# EAGLE design fanRegulator2 (EAGLE 7.6.0)

## Sheet 1 of 2
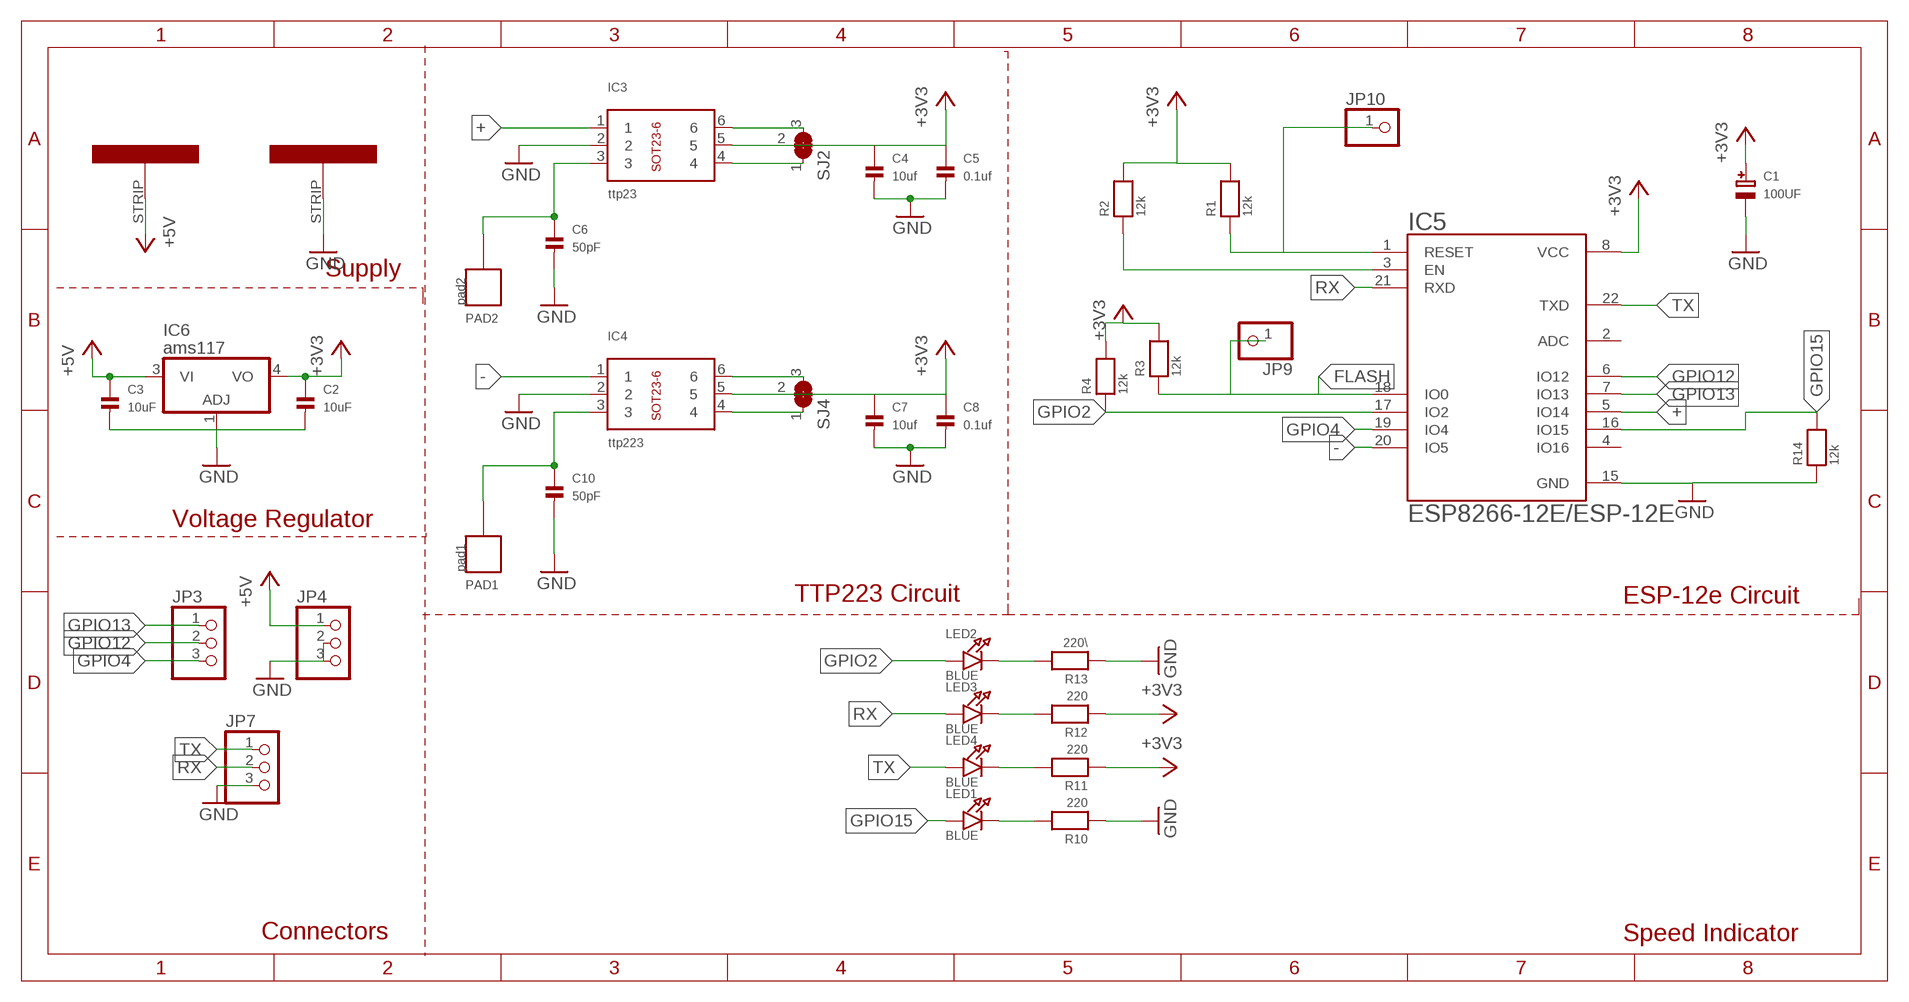
[diagram p0: schematic, sheet 1]

### Parts
C1  100UF  CAP_TANTALUMC/6032_WAVE  [EIA6032-28/C-W]
C2  10uF  CAP_CERAMIC0805  [0805]
C3  10uF  CAP_CERAMIC0805  [0805]
C4  10uf  CAP_CERAMIC0805  [0805]
C5  0.1uf  CAP_CERAMIC0805  [0805]
C6  50pF  CAP_CERAMIC0805  [0805]
C7  10uf  CAP_CERAMIC0805  [0805]
C8  0.1uf  CAP_CERAMIC0805  [0805]
C10  50pF  CAP_CERAMIC0805  [0805]
IC3  ttp23  BREAKOUT_SOT23-6  [BREAKOUT_SOT23-6]
IC4  ttp223  BREAKOUT_SOT23-6  [BREAKOUT_SOT23-6]
IC5  ESP8266-12E/ESP-12E  [XCVR_ESP8266-12E/ESP-12E]
IC6  ams117  317EMP  [SOT223]
JP3  PINHD-1X3  [1X03]
JP4  PINHD-1X3  [1X03]
JP7  PINHD-1X3CB  [1X03-CLEANBIG]
JP9  PINHD-1X1  [1X01]
JP10  PINHD-1X1  [1X01]
LED1  BLUE  LED0805  [CHIPLED_0805]
LED2  BLUE  LED0805  [CHIPLED_0805]
LED3  BLUE  LED0805  [CHIPLED_0805]
LED4  BLUE  LED0805  [CHIPLED_0805]
PAD1  pad1  CAP_TOUCHPAD  [CAP_TOUCHPAD]
PAD2  pad2  CAP_TOUCHPAD  [CAP_TOUCHPAD]
R1  12k  RESISTOR0805  [0805]
R2  12k  RESISTOR0805  [0805]
R3  12k  RESISTOR0805  [0805]
R4  12k  RESISTOR0805  [0805]
R10  220  RESISTOR0805  [0805]
R11  220  RESISTOR0805  [0805]
R12  220  RESISTOR0805  [0805]
R13  220\  RESISTOR0805  [0805]
R14  12k  RESISTOR0805  [0805]
SJ2  SOLDERJUMPER_2WAY0603  [SOLDERJUMPER_2WAY_OPEN_0603]
SJ4  SOLDERJUMPER_2WAY0603  [SOLDERJUMPER_2WAY_OPEN_0603]
U$2  STRIP  [STRIP]
U$3  STRIP  [STRIP]

### Nets
+: IC3.1 IC5.5(IO14)
+3V3: C1.+ C2.1 C4.1 C5.1 C7.1 C8.1 IC3.5 IC4.5 IC5.8(VCC) IC6.4(VO) R1.2 R2.2 R3.2 R4.2 R11.1 R12.1 SJ2.2 SJ4.2
+5V: C3.1 IC6.3(VI) JP4.1 U$2.STRIP
-: IC4.1 IC5.20(IO5)
FLASH: IC5.18(IO0) JP9.1 R3.1
GND: C1.- C2.2 C3.2 C4.2 C5.2 C6.2 C7.2 C8.2 C10.2 IC3.2 IC4.2 IC5.15(GND) IC6.1(ADJ) JP4.2 JP4.3 JP7.3 R10.1 R13.1 R14.1 U$3.STRIP
GPIO2: IC5.17(IO2) LED2.A R4.1
GPIO4: IC5.19(IO4) JP3.3
GPIO12: IC5.6(IO12) JP3.2
GPIO13: IC5.7(IO13) JP3.1
GPIO15: IC5.16(IO15) LED1.A R14.2
N$2: C6.1 IC3.3 PAD2.P$1
N$3: IC5.1(RESET) JP10.1 R1.1
N$4: IC5.3(EN) R2.1
N$5: IC3.6 SJ2.3
N$7: IC3.4 SJ2.1
N$9: C10.1 IC4.3 PAD1.P$1
N$10: IC4.6 SJ4.3
N$11: IC4.4 SJ4.1
N$19: LED1.C R10.2
N$20: LED4.C R11.2
N$21: LED3.C R12.2
N$24: LED2.C R13.2
RX: IC5.21(RXD) JP7.2 LED3.A
TX: IC5.22(TXD) JP7.1 LED4.A
Unconnected: IC5.2(ADC) IC5.4(IO16)

### Notes on the sheet
- Supply
- Voltage Regulator
- TTP223 Circuit | ESP-12e Circuit
- Connectors | Speed Indicator

## Sheet 2 of 2
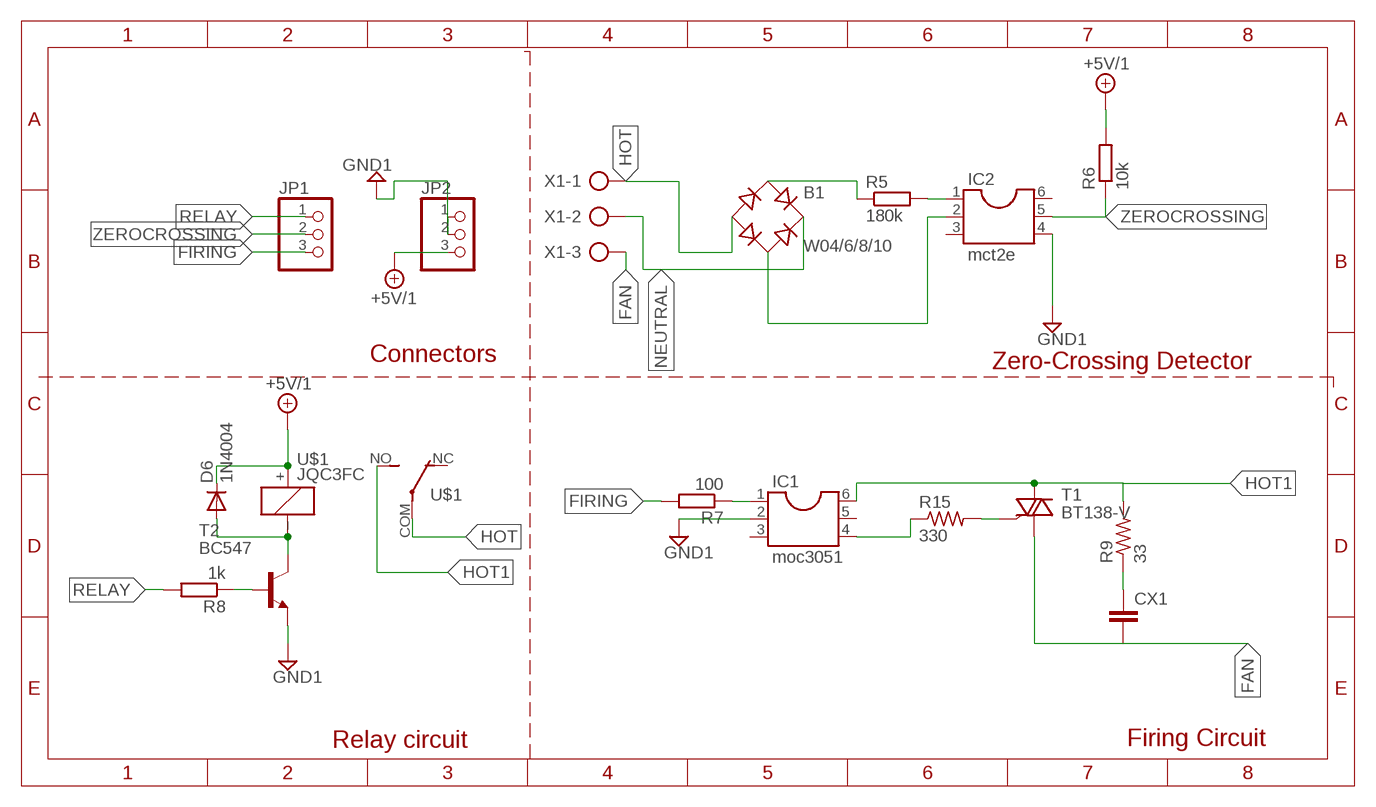
[diagram p1: schematic, sheet 2]

### Parts
B1  W04/6/8/10  RB1A  [RB1A]
CX1  C-EU050-024X044  [C050-024X044]
D6  1N4004  [DO41-10]
IC1  moc3051  DIL6  [DIL06]
IC2  mct2e  DIL6  [DIL06]
JP1  PINHD-1X3  [1X03]
JP2  PINHD-1X3  [1X03]
R5  180k  R-EU_0309/V  [0309V]
R6  10k  R-EU_0204/2V  [0204V]
R7  100  R-EU_0204/2V  [0204V]
R8  1k  R-EU_0204/2V  [0204V]
R9  33  R-US_0411/3V  [0411V]
R15  330  R-US_0207/2V  [0207/2V]
T1  BT138-V  [TO220BV]
T2  BC547  [TO92]
U$1  JQC3FC  [JQC3FC]
X1  AK500/3-H  [AK500/3-H]

### Nets
+5V/1: D6.C JP2.3 R6.2 U$1.+
FAN [AC]: CX1.2 T1.T1(A1) X1.3
FIRING: JP1.3 R7.2
GND1: IC1.2 IC2.4 JP2.1 JP2.2 T2.1(E)
HOT [AC]: B1.- U$1.COM X1.1
HOT1 [AC]: IC1.6 R9.2 T1.T2(A2) U$1.NO
N$1 [zerocross]: B1.AC1 R5.1
N$8 [zerocross]: B1.AC2 IC2.2
N$12 [zerocross]: IC2.1 R5.2
N$13: IC1.1 R7.1
N$14 [AC]: IC1.4 R15.1
N$15 [AC]: R15.2 T1.G
N$16 [AC]: CX1.1 R9.1
N$17: D6.A T2.3(C) U$1._(-)
N$18: R8.1 T2.2(B)
NEUTRAL [AC]: B1.+ X1.2
RELAY: JP1.1 R8.2
ZEROCROSSING: IC2.5 JP1.2 R6.1
Unconnected: IC1.3 IC1.5 IC2.3 IC2.6 U$1.NC

### Notes on the sheet
- Connectors
- Zero-Crossing Detector
- Relay circuit | Firing Circuit

## Library data of the parts
B1 = rectifier:RB1A: RECTIFIER 1 A
C1 = microbuilder:CAP_TANTALUM: Tantalum Capacitors Wave footprints have larger pads and are meant to be used for hand soldering. Reflow footprints are optimised for solder paste and a reflow oven. EIA3216-18/A-[R/W] - Size A / 3216-18 / 1206 footprint 4.7µF 25V 10% Tantalum Capacitor 10µF 16V 10% Tantalum Capacitor [Digikey: 495-2236-2-ND] EIA3528-21/B-[R/W] - Size B / 3528-21 47µF 10V 10% Tantalum Capactior [Digikey: 495-2216-1-ND] EIA6032-28/C-[R/W] - Size C / 6032-28 10µF 35V 20% Tantalum Capacitor [Digikey: 495-2285-1-ND] 100µF 16V 10% Tantalum Capactior [Digikey: 399-5214-1-ND]
C2-C8 C10 = microbuilder:CAP_CERAMIC: Ceramic Capacitors 0402 - 0402 Surface Mount Capacitors 16pF 50V 5% [Digikey: 445-4899-2-ND] 18pF 50V 5% [Digikey: 490-1281-2-ND] 22pF 50V 5% [Digikey: 490-1283-2-ND] 68pF 50V 5% [Digikey: 490-1289-2-ND] 0.1uF 10V 10% [Digikey: 490-1318-2-ND] 1.0uF 6.3V 10% [Digikey: 490-1320-2-ND] 0603 - 0603 Surface Mount Capacitors 16 pF 50V 5% [Digikey: 445-5051-2-ND] 22 pF 50V [Digikey: PCC220ACVTR-ND] 33 pF 50V 5% [Digikey: 490-1415-1-ND] 56pF 50V 5% [Digikey: 490-1421-1-ND] 220pF 50V 5% [Digikey: 445-1285-1-ND] 680 pF 50V 2200 pF 50V 5% C0G [Digikey: 445-1297-1-ND] 5600 pF 100V 5% X7R [Digikey: 478-3711-1-ND] 0.1 µF 25V 10% [Digikey: PCC2277TR-ND] 0.22 µF 16V 10% X7R [Digikey: 445-1318-1-ND] 1.0 µF 25V 10% [Digikey: 445-5146-2-ND] 0603 - RF Specific 3pF 250V +/-0.1pF RF [Digikey: 712-1347-1-ND] 18 pF 250V 5% [Digikey: 478-3505-1-ND or 712-1322-1-ND] 56 pF 250V 5% C0G RF [Digikey: 490-4867-1-ND] 68 pF 250V RF [Digikey: 490-4868-1-ND] 0805 - 0805 Surface Mount Capacitors 220 pF 250V 2% RF Ceramic Capacitor [Digikey: 712-1398-1-ND] 1000 pF 50V 2% NP0 Ceramic Capacitor [Digikey: 478-3760-1-ND] 0.1 µF 25V 10% Ceramic Capacitor [Digikey: PCC1828TR-ND] 1.0 µF 16V 10% Ceramic Capacitor[Digikey: 490-1691-2-ND] 10.0 µF 10V 10% Ceramic Capacitor[Digikey: 709-1228-1-ND] 10.0 uF 16V 10% Ceramic Capacitor [Digikey: 478-5165-2-ND] 47 uF 6.3V 20% Ceramic Capacitor [Digikey: 587-1779-1-ND or 399-5506-1-ND] 1206 - 1206 Surface Mount Capacitors 47uF 10V 20% Ceramic Capacitor [Digikey: 490-5528-1-ND or 399-5508-1-ND or 445-6010-1-ND] 100uF 6.3V -20%, +80% Y5V Ceramic Capacitor (Digikey: 490-4512-1-ND, Mouser: 81-GRM31CF50J107ZE1L)
CX1 = resistor:C-EU: CAPACITOR, European symbol
D6 = adafruit:1N4004: DIODE General purpose 1N400x type rectifier (With bigger pads) http://www.ladyada.net/library/pcb/eaglelibrary.html
IC1 IC2 = ic-package:DIL6: Dual In Line / Socket
IC3 IC4 = microbuilder:BREAKOUT_SOT23-6: IC Breakout SOT23-6
IC5 = ESP8266-12E_ESP-12E:ESP8266-12E/ESP-12E: ESP-12E WiFi Module; AVAILABILITY: Unavailable; DESCRIPTION: This WiFi module has a 32-bit MCU micro and clock speeds supporting 80 MHz or 160 MHz. Supports the RTOS and integrated Wi-Fi MAC/BB/RF/PA/LNA, and has an on-board antenna.; MF: AI-Thinker; MP: ESP8266-12E/ESP-12E; PACKAGE: None; PRICE: None
IC6 = linear:*317: Positive VOLTAGE REGULATOR
JP1-JP4 JP7 = adafruit:PINHD-1X3: PIN HEADER
JP9 JP10 = adafruit:PINHD-1X1: Pin header 1x1 for 0.1" spacing With round pins
LED1-LED4 = microbuilder:LED: LED 0603 - 0603 Surface Mount Package 2mA: Green LED - Low Power (3.9mcd, 2ma, 1.7Vf) - Digikey: 475-2709-2-ND Orange LED - Low Power (9.8mcd, 2ma, 1.8Vf) - Digikey: 475-1194-2-ND Red LED - Low Power (5mcd, 2ma, 1.8Vf) - Digikey: 475-1195-2-ND Yellow LED - Low Power (7mcd, 2ma, 1.8Vf) - Digikey: 475-1196-2-ND 5mA: Blue LED - Low Power (17mcd, 5ma, 2.9Vf) - Digikey: LNJ937W8CRACT-ND 0805 - 0805 Surface Mount Package 2mA: Red LED (8.8mcd, 2mA, 1.8Vf, Clear) - Low Power [Digikey: 475-2510-1-ND] Green LED (5mcd, 2mA, 1.8Vf, Clear) - Low Power [Digikey: 475-2730-1-ND] Yellow LED (11.3mcd, 2mA, 1.8Vf, Clear) - Low Power [Digikey: 475-2555-1-ND] 20mA: Red LED (104mcd, 20mA, Diffused) - LS R976 [Digikey: 475-1278-6-ND] Red LED (12mcd, 20mA, 2.0Vf, Clear) - APT2012EC [Digikey: 754-1128-1-ND] Green LED (15mcd, 20mA, 2.2Vf, Clear) - APT2012GC [Digikey: 754-1131-1-ND] Orange LED (160mcd, 20mA, 2.1Vf, Clear) - APT2012SECK [Digikey: 754-1130-1-ND] 1206 - 1206 Surface Mount Package Green LED (26mcd, 20mA, Diffused) - LG N971 [Digikey: 475-1407-6-ND] Red LED (15mcd, 20mA, Diffused) - LH N974 [Digikey: 475-1416-6-ND]
PAD1 PAD2 = Alfred:CAP_TOUCHPAD
R1-R4 R10-R14 = microbuilder:RESISTOR: Resistors 0402 - 0402 Surface Mount Package 22 Ohm 1% 1/16W [Digikey: 311-22.0LRTR-ND] 33 Ohm 5% 1/16W 1.0K 5% 1/16W 1.5K 5% 1/16W 2.0K 1% 1/16W 10.0K 1% 1/16W [Digikey: 311-10.0KLRTR-ND] 10.0K 5% 1/16W [Digikey: RMCF0402JT10K0TR-ND] 12.1K 1% 1/16W [Digikey: 311-22.0LRTR-ND] 100.0K 5% 1/16W 0603 - 0603 Surface Mount Package 0 Ohm 1/10 Watt 1% Resistor 15 Ohm 1/10 Watt 1% Resistor 33 Ohm 1/10 Watt 1% Resistor 49.9 Ohm 1/10 Watt 1% Resistor 100 Ohm 1/10 Watt 1% Resistor 150 Ohm 1/10 Watt 1% Resistor 240 Ohm 1/10 Watt 1% Resistor 390 Ohm 1/10 Watt 1% Resistor 560 Ohm 1/10 Watt 1% Resistor 680 Ohm 1/10 Watt 1% Resistor 750 Ohm 1/10 Watt 1% Resistor 1.0K Ohm 1/10 Watt 1% Resistor 1.5K Ohm 1/10 Watt 1% Resistor 2.0K Ohm 1/10 Watt 1% Resistor 2.2K Ohm 1/10 Watt 1% Resistor 3.3K Ohm 1/10 Watt 1% Resistor 4.7K Ohm 1/10 Watt 1% Resistor 10.0K Ohm 1/10 Watt 1% Resistor 12.0K Ohm 1/10 Watt 1% Resistor 12.1K Ohm 1/10 Watt 1% Resistor 20.0K Ohm 1/10 Watt 1% Resistor 33.0K Ohm 1/10 Watt 1% Resistor 100.0K Ohm 1/10 Watt 1% Resistor 0805 - 0805 Surface Mount Package 0 Ohm 1/8 Watt 1% Resistor 33 Ohm 1/8 Watt 1% Resistor 100 Ohm 1/8 Watt 1% Resistor 150 Ohm 1/8 Watt 1% Resistor 200 Ohm 1/8 Watt 1% Resistor 240 Ohm 1/8 Watt 1% Resistor 330 Ohm 1/8 Watt 1% Resistor 390 Ohm 1/8 Watt 1% Resistor 470 Ohm 1/8 Watt 1% Resistor 1.0K Ohm 1/8 Watt 1% Resistor 1.5K Ohm 1/8 Watt 1% Resistor 2.0K Ohm 1/8 Watt 1% Resistor 4.7K Ohm 1/8 Watt 1% Resistor 5.1K Ohm 1/8 Watt 1% Resistor 5.6K Ohm 1/8 Watt 1% Resistor 10.0K Ohm 1/8 Watt 1% Resistor 22.0K Ohm 1/8 Watt 1% Resistor 33.0K Ohm 1/8 Watt 1% Resistor 100K Ohm 1/8 Watt 1% Resistor 1206 - 1206 Surface Mount Package 2012 - 2010 Surface Mount Package 0.11 Ohm 1/2 Watt 1% Resistor - Digikey: RHM.11UCT-ND
R5-R8 = rcl:R-EU_: RESISTOR, European symbol
R9 R15 = adafruit:R-US_: RESISTOR, American symbol
SJ2 SJ4 = microbuilder:SOLDERJUMPER_2WAY: 2-Way Solder Jumper
T1 = triac:BT138: TRIAC Source: http://www.semiconductors.philips.com BT138_SERIES_2.pdf
T2 = transistor:BC547: NPN TRANSISTOR
U$1 = Alfred:JQC3FC
U$2 U$3 = Alfred:STRIP
X1 = con-ptr500:AK500/3-H: CONNECTOR Aug. 2004 / PTR Meßtechnik: Die Bezeichnung der Serie AK505 wurde geändert. Es handelt sich hierbei um AK500 in horizontaler Ausführung.; OC_FARNELL: unknown; OC_NEWARK: unknown

## Net classes
0 default: width 0.4 mm, clearance 0.381 mm
1 AC: width 1.5 mm, clearance 0.381 mm to class 0, clearance 0.381 mm
3 zerocross: width 0.35 mm, drill 0.7 mm, clearance 0.5 mm to class 0, clearance 0.5 mm to class 1, clearance 0.5 mm to class 2, clearance 0.3 mm

## Board
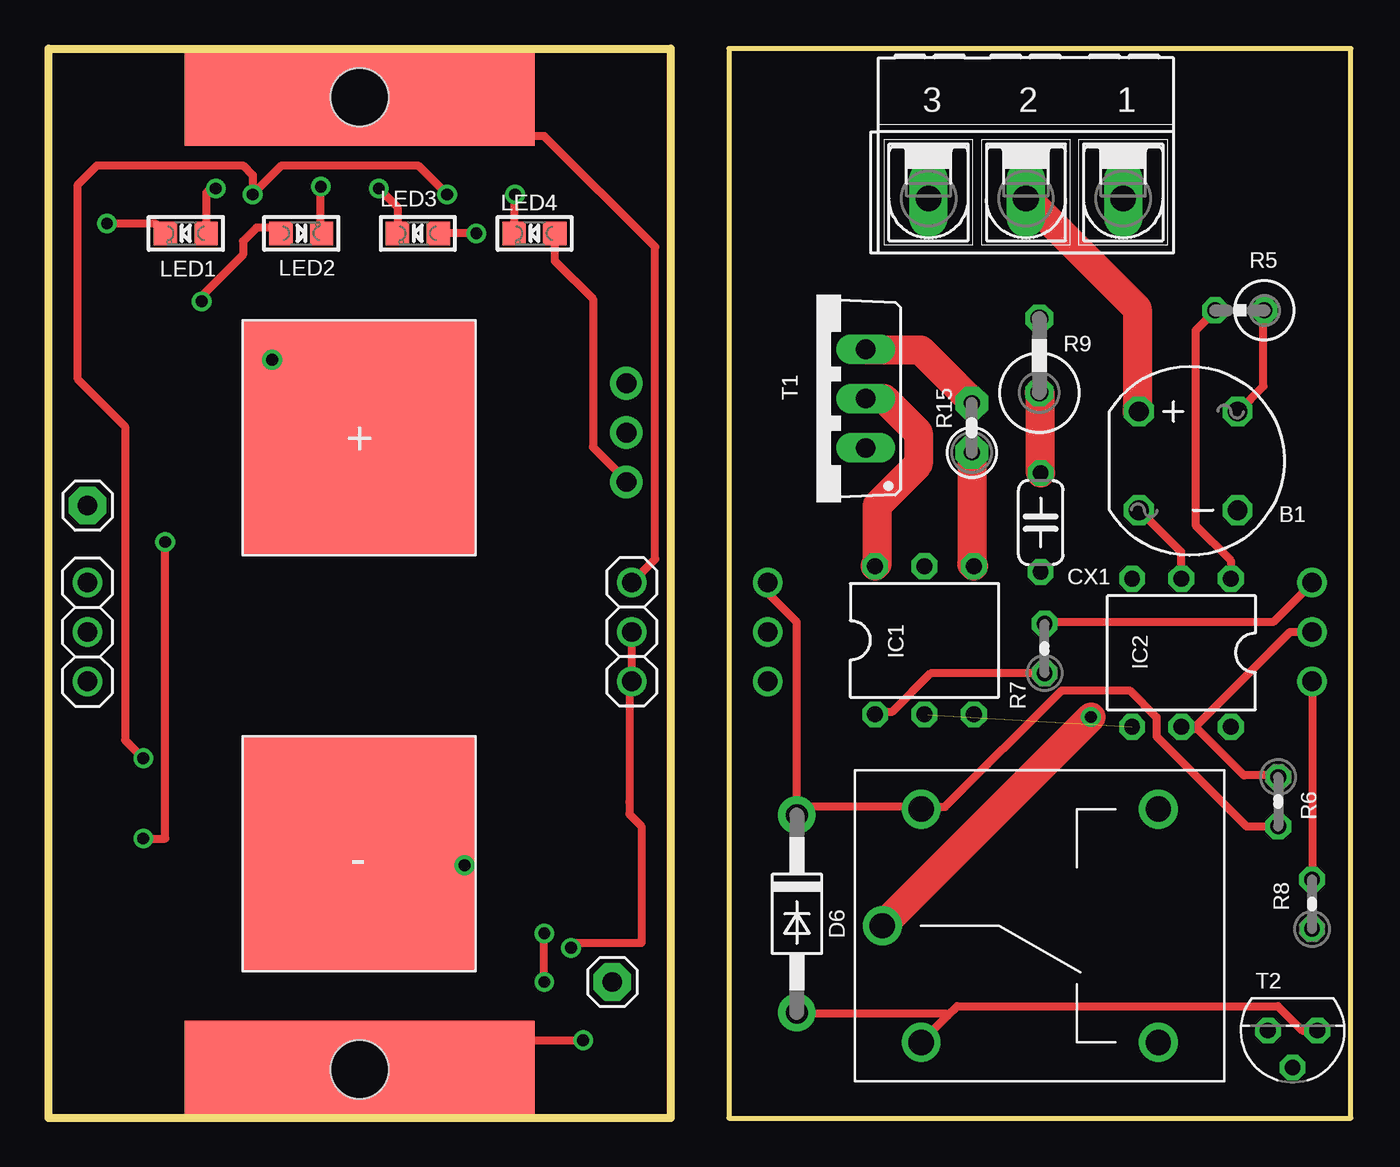
[diagram p2: board, top side]
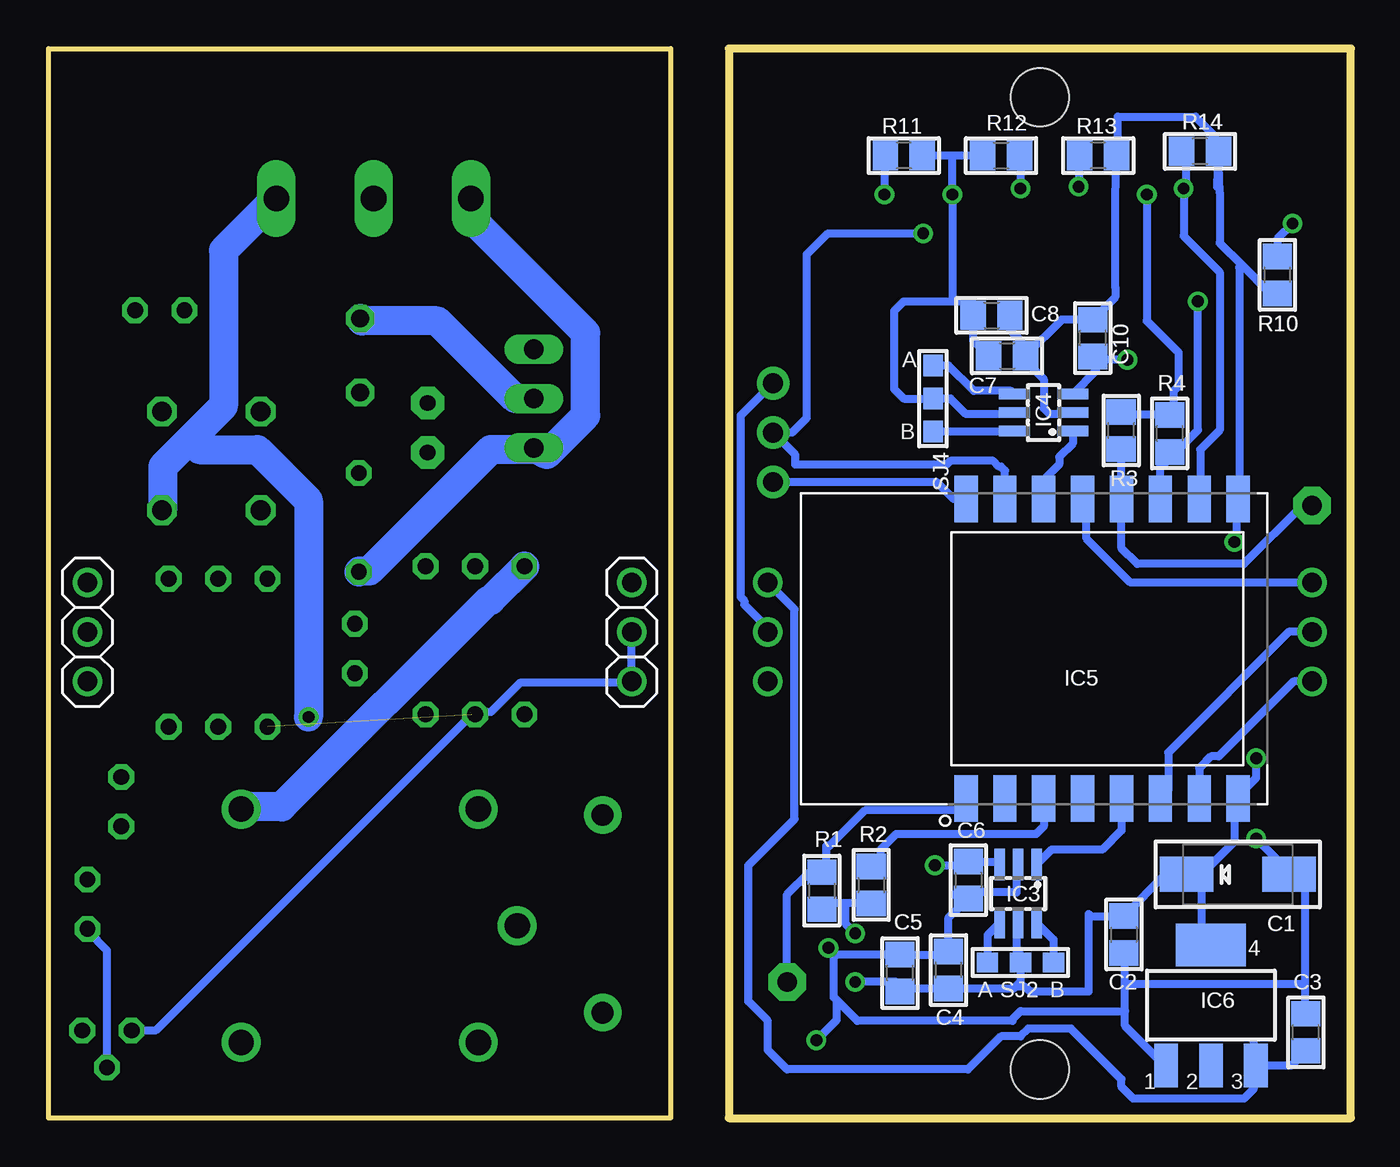
[diagram p3: board, bottom side, seen from below]

Size 67 x 55 mm. Coordinates in mm from the lower left corner, seen from the top.
Outline: 35,0 67,0 67,55 35,55 35,0
Outline: 0,0 0,55 32,55 32,0 0,0
Copper layers (1*16): Top 0.035mm / dielectric 1.5mm / Bottom 0.035mm
Design rules "default *": minimum track width 0.4mm, minimum drill 24mil, track to track 12mil, track to pad 12mil, pad to pad 12mil, via to via 12mil, smd to smd 8mil, copper to edge 0.3mm, drill to drill 8mil, minimum pad ring 10mil, minimum via ring 8mil, stop-mask expansion 4mil, vias tented up to drill 0mil, thermal gap 10mil

### Footprints (pad centres in the part's own frame; a part is rotated, then mirrored left to right if it is on the bottom)
RB1A = drill 1.016 octagon: + -2.54,2.54; - 2.54,-2.54; AC1 2.54,2.54; AC2 -2.54,-2.54
EIA6032-28/C-W = smd 2.75 x 1.8: + 2.625,0; - -2.625,0
0805 = smd 1.3 x 1.5: 1 -0.95,0; 2 0.95,0
C050-024X044 = drill 0.813 octagon: 1 -2.54,0; 2 2.54,0
DO41-10 = drill 1.118 pad 1.93: A 5.08,0; C -5.08,0
DIL06 = drill 0.813 octagon: 1 -2.54,-3.81; 2 0,-3.81; 3 2.54,-3.81; 4 2.54,3.81; 5 0,3.81; 6 -2.54,3.81
BREAKOUT_SOT23-6 = smd 0.55 x 1.6: 1 -0.95,-1.5; 2 0,-1.5; 3 0.95,-1.5; 4 0.95,1.5; 5 0,1.5; 6 -0.95,1.5
XCVR_ESP8266-12E/ESP-12E = smd 2.4 x 1.2: 1 -7.7,7; 2 -7.7,5; 3 -7.7,3; 4 -7.7,1; 5 -7.7,-1; 6 -7.7,-3; 7 -7.7,-5; 8 -7.7,-7; 15 7.7,-7; 16 7.7,-5; 17 7.7,-3; 18 7.7,-1; 19 7.7,1; 20 7.7,3; 21 7.7,5; 22 7.7,7
SOT223 = smd 1.219 x 2.235: 1 -2.311,-3.099; 2 0,-3.099; 3 2.311,-3.099 | smd 3.6 x 2.2: 4 0,3.099
1X03 = drill 1.016: 1 -2.54,0; 2 0,0; 3 2.54,0
1X03-CLEANBIG = drill 1.016 pad 1.676: 1 -2.54,0; 2 0,0; 3 2.54,0
1X01 = drill 1.016 pad 1.93 octagon: 1 0,0
CHIPLED_0805 = smd 1.2 x 1.2: A 0,-1.05; C 0,1.05
CAP_TOUCHPAD = smd 12 x 12: P$1 0,0
0309V = drill 0.813 octagon: 1 -1.27,0; 2 1.27,0
0204V = drill 0.813 octagon: 1 -1.27,0; 2 1.27,0
0411V = drill 0.914 octagon: 1 -2.54,0; 2 1.27,0
0207/2V = drill 0.813 pad 1.676 octagon: 1 -1.27,0; 2 1.27,0
SOLDERJUMPER_2WAY_OPEN_0603 = smd 1.1 x 1: 1 -1.7,0; 2 0,0; 3 1.7,0
TO220BV = drill 1.016 long: G 2.54,-2.54; T1 -2.54,-2.54; T2 0,-2.54
TO92 = drill 0.813 octagon: 1 1.27,0; 2 0,1.905; 3 -1.27,0
JQC3FC = drill 1.3 pad 2: + -6.2,6; _ -6.2,-6; COM -8.2,0; NC 6,-6; NO 6,6
STRIP = smd 18 x 5: STRIP 0,0 | hole 3: 0,0
AK500/3-H = drill 1.321 long: 1 -5.004,0; 2 0,0; 3 5.004,0

### Placement (x,y rotation side)
B1  58.63,33.8 0 top
C1  5.82,12.53 180 bottom
C2  11.68,9.44 270 bottom
C3  2.32,4.41 90 bottom
C4  20.7,7.61 90 bottom
C5  23.2,7.46 90 bottom
C6  19.68,12.24 270 bottom
C7  17.69,39.2 0 bottom
C8  18.49,41.28 0 bottom
C10  13.28,40.11 90 bottom
CX1  51.04,30.63 270 top
D6  38.5,10.5 270 top
IC1  45.06,24.57 0 top
IC2  58.28,23.93 180 top
IC3  17.12,11.54 180 bottom
IC4  15.81,36.28 90 bottom
IC5  12.8,24.14 90 bottom
IC6  7.2,5.8 0 bottom
JP1  65,25 90 bottom
JP2  37,25 90 bottom
JP3  2,25 90 top
JP4  30,25 270 top
JP7  29.73,35.25 90 top
JP9  2,31.5 0 top
JP10  29,7 0 top
LED1  7.06,45.5 90 top
LED2  13,45.5 270 top
LED3  19,45.5 90 top
LED4  25,45.5 90 top
PAD1  16,35 0 top
PAD2  16,13.6 0 top
R1  27.22,11.69 270 bottom
R2  24.68,11.99 270 bottom
R3  11.82,35.36 90 bottom
R4  9.32,35.21 90 bottom
R5  61.28,41.54 180 top
R6  63.26,16.27 270 top
R7  51.24,24.15 90 top
R8  65,11 90 top
R9  50.97,39.85 90 top
R10  3.78,43.36 90 bottom
R11  23,49.5 180 bottom
R12  18,49.5 0 bottom
R13  13,49.5 180 bottom
R14  7.76,49.72 180 bottom
R15  47.5,35.5 90 top
SJ2  17,8 0 bottom
SJ4  21.5,37 270 bottom
T1  39.5,37 90 top
T2  64,4.5 180 top
U$1  51.09,9.89 0 top
U$2  16,52.5 0 top
U$3  16,2.5 0 top
X1  50.28,47.29 180 top

### Tracks (layer width: path | path; a pad name or v marks a point on that pad's centre or on a via)
+
  Bottom 0.406: IC5.5 11.8,14.8 12.8,13.8 15.41,13.8 IC3.1
+3V3  (via drill 0.6, 0.61)
  Top 0.406: v4.88,18.5 3.94,19.44 3.94,35.56 1.5,38 1.5,48 2.5,49 10,49 10.5,48.5 v10.5,47.5 12,49 19,49 v20.5,47.5 | v25.5,7 v25.5,9.5
  Bottom 0.4: 8.88,38.62 8.88,37.62 9.12,37.38 9.12,36.25 R4.2 | v4.88,18.5 4.88,17.5 5.75,16.62 IC5.8 | v20.5,47.5 20.5,49.5
  Bottom 0.406: IC5.8 6,16.24 6,14.2 7.67,12.53 | 7.67,12.53 C1.+ 9.54,12.53 C2.1 13.39,10.39 13.5,10.5 13.5,6.5 16.5,6.5 16.75,6.75 17.25,6.75 | IC6.4 7.67,9.37 7.67,12.53 | R4.2 11.67,36.16 R3.2 | C7.1 19.44,40 C8.1 19.44,41.94 19.5,42 20.5,42 | R2.2 26,11.04 | 26,11.04 26.92,11.04 R1.2 | 20.64,6.6 C4.1 | C4.1 23.05,6.66 | 23.05,6.66 C5.1 | v10.5,47.5 10.5,41 8.88,39.38 8.88,38.62 | 23.05,6.66 23.39,7 v25.5,7 | v25.5,9.5 26,10 26,11.04 | IC4.5 17.39,36.2 19.8,36.2 20.6,37 SJ4.2 23,37 23.5,37.5 23.5,41.5 23,42 20.5,42 | 17.25,6.75 17,7 SJ2.2 17,8.4 17.2,8.6 17.2,9.96 IC3.5 | 17.25,6.75 17.34,6.66 C4.1 | R12.1 20.5,49.5 R11.1 | v20.5,47.5 20.5,42
+5V
  Top 0.4: 30,27.5 JP4.1
  Top 0.406: JP4.1 31.2,28.74 31.2,44.8 25.5,50.5 23.5,50.5 21.5,52.5 U$2.STRIP
  Bottom 0.4: 5,3.88 5,2.88 IC6.3
  Bottom 0.406: C3.1 3.08,2.7 IC6.3 | 5,3.88 5,1.5 5.5,1 11.2,1 11.8,1.6 11.8,2 14.4,4.6 16.6,4.6 17,4.2 18,4.2 19.7,2.5 29,2.5 30,3.5 30,5 31,6 31,13 28.62,15.38 28.62,26.16 JP4.1
+5V/1
  Top 0.4: JP2.3 37,27 38.5,25.5 D6.C 38.62,16 44.75,16 U$1.+ 45,16 46.12,16 52.12,22 55.62,22 57,20.62 57,19.62 61.62,15 R6.2
-
  Bottom 0.406: IC5.20 15.8,32.82 15,33.62 15,34 14.31,34.69 IC4.1
FAN
  Bottom 1.5: CX1.2 51,28.12 50.5,28.12 44.25,34.38 42.12,34.38 T1.T1 41.38,34.12 39.38,36.12 39.38,40.38 45.25,46.25 45.25,47.25 X1.3
FIRING
  Top 0.4: R7.2 51.25,25.5 63,25.5 65,27.5 JP1.3
FLASH
  Bottom 0.406: R3.1 11.8,34.39 IC5.18 11.8,29.3 11,28.5 5.5,28.5 2.5,31.5 JP9.1
GND  (via drill 0.6, 0.61)
  Top 0.4: v4.88,14.38 6,14.38 v6,29.62 | JP4.2 JP4.3 29.88,22.38 29.88,16.25
  Top 0.406: 29.88,16.25 29.88,15.62 30.5,15 30.5,9 27.12,9 v26.88,8.75 | U$3.STRIP 17.5,4 v27.5,4
  Bottom 0.4: 5.62,43.88 6.75,45 6.75,47.62 R14.1 6.88,47.88 6.88,48.12 | 5.62,43.88 4.25,42.5 3.88,42.5 R10.1 | 5.62,43.88 5.75,43.75 5.75,31.88 IC5.15 5.88,31.75 5.88,29.75 v6,29.62 | 12.12,42.75 12.12,47.5 R13.1 | 11.62,6.88 11.62,5.5 11.62,4.75 9.62,2.75 IC6.1 | 11.62,6.88 11.62,8.38 C2.2 | 2.38,6.88 2.38,11.75 3.12,12.5 C1.- 3.12,12.62 v4.88,14.38 | 2.38,6.88 2.38,5.38 C3.2 | 2.38,6.88 11.62,6.88
  Bottom 0.406: 12.12,42.75 12.12,42.22 C10.2 14.88,41.06 C7.2 | C8.2 17.54,40.54 17,40 17,39.46 C7.2 | C7.2 16.74,38.94 15.8,38 15.8,36.5 15.5,36.2 14.39,36.2 IC4.2 | 26.62,8.5 v26.88,8.75 26.5,8.38 | 26.5,8.38 26.46,8.41 C5.2 20.85,8.41 C4.2 20.7,10.31 C6.2 | 26.45,6.05 25.4,5 17.4,5 17.4,5.1 17,5.5 11.62,5.5 | 26.45,6.05 26.6,6.2 26.6,8.28 26.5,8.38 | 20.47,11.5 C6.2 | JP4.2 30,25.2 31.2,26.4 31.2,26.6 31.4,26.8 31.4,36.12 JP7.3 | v27.5,4 26.45,5.05 26.45,6.05 | IC3.2 17.2,12.96 17.2,11.6 19.37,11.6 C6.2 | R13.1 12,49.55 12,51.5 8,51.5 7,50.5 7,49.91 R14.1
GND1  (1 unrouted)
  Bottom 0.4: T2.1 61.5,4.5 45.25,20.75 IC1.2 45,20.88 44.25,20.88 42.75,22.38 37,22.38 JP2.1 JP2.2
GPIO2  (via drill 0.61)
  Top 0.406: LED2.A 12.15,45.8 10.7,45.8 10,45.1 10,44.4 7.88,42.27 v7.88,42
  Bottom 0.4: v7.88,42 7.88,35.38 9.62,33.62 R4.1
  Bottom 0.406: IC5.17 9.8,33.78 R4.1
GPIO4
  Bottom 0.406: JP3.3 11.34,27.54 13.6,29.8 13.6,31.64 IC5.19
GPIO12
  Bottom 0.406: JP3.2 3.2,25 9.4,18.8 9.4,16.84 IC5.6
GPIO13
  Bottom 0.406: JP3.1 2.94,22.46 6.8,18.6 7.2,18.6 7.8,18 IC5.7
GPIO15  (via drill 0.6)
  Top 0.406: v8.6,47.8 8.11,47.61 LED1.A
  Bottom 0.4: 6.75,43.5 6.75,35.38 7.75,34.38 7.75,31.88 IC5.16
  Bottom 0.406: R14.2 8.5,49.51 8.5,47.9 v8.6,47.8 8.6,45.35 6.75,43.5
HOT  (via drill 0.61)
  Top 1.5: v53.62,20.62 U$1.COM
  Bottom 1.5: 59.75,34.88 58,36.62 58,44.62 55.38,47.25 X1.1 | 59.75,34.88 61.12,33.5 61.12,31.38 B1.- | v53.62,20.62 53.62,31.75 56.25,34.38 59.25,34.38 59.75,34.88
HOT1
  Top 1.5: T1.T2 43,37 44.75,35.25 44.75,33.62 42.62,31.5 42.62,28.5 IC1.6
  Bottom 1.5: T1.T2 43,37 47,41 50.88,41 R9.2 | U$1.NO 57,16 55,16 44.38,26.62 44.25,26.62 42.5,28.38 IC1.6
N$1
  Top 0.406: R5.1 62.5,41.5 62.5,37.62 61.25,36.38 B1.AC1
N$2  (via drill 0.6)
  Top 0.406: PAD2.P$1 20.9,13.6 v21.4,13
  Bottom 0.406: v21.4,13 19.87,13 C6.1 18.22,13.19 IC3.3
N$3
  Bottom 0.406: IC5.1 19.8,16 19.98,15.82 24.99,15.82 26.82,14 27,14 27,12.86 R1.1 | 27.36,12.5 R1.1 | JP10.1 29,11.5 27.86,12.64 R1.1
N$4
  Bottom 0.406: IC5.3 15.8,15 16.2,14.6 23.4,14.6 24.2,13.8 24.2,12.96 R2.1
N$5
  Bottom 0.406: 16.2,10.01 IC3.6 15.3,9.17 SJ2.3
N$7
  Bottom 0.406: IC3.4 18.7,9.41 SJ2.1
N$8
  Top 0.406: IC2.2 58.25,27.75 58.25,29.12 56.12,31.25 B1.AC2
N$9  (via drill 0.6)
  Top 0.406: PAD1.P$1 15.5,35 v11.5,39
  Bottom 0.406: v11.5,39 13.12,39 | 13.12,39 C10.1 | 13.12,39 13.12,38.42 IC4.3
N$10
  Bottom 0.406: IC4.6 17.34,35.3 SJ4.3
N$11
  Bottom 0.406: IC4.4 17.48,37.4 19.4,37.4 20.7,38.7 SJ4.1
N$12
  Top 0.406: 60.75,27.75 IC2.1 60.82,28.68 59,30.5 59,40.5 60,41.5 R5.2
N$13
  Top 0.4: IC1.1 42.62,20.88 43.38,20.88 45.38,22.88 51.12,22.88 R7.1
N$14
  Top 1.5: R15.1 47.5,28.5 IC1.4
N$15
  Top 1.5: T1.G 42.12,39.5 44.88,39.5 47.5,36.88 R15.2
N$16
  Top 1.5: CX1.1 51,33.25 51,37.25 R9.1
N$17
  Top 0.4: T2.3 64.5,4.5 63.25,5.75 46.75,5.75 46.25,5.25 | U$1._ 46.25,5.25 | D6.A 38.5,5.38 46.12,5.38 46.25,5.25
N$18
  Bottom 0.4: T2.2 64,8.62 65,9.62 R8.1
N$19  (via drill 0.6)
  Top 0.406: LED1.C 5.51,46 v3,46
  Bottom 0.406: v3,46 3.78,45.22 R10.2
N$20  (via drill 0.6)
  Top 0.406: v24,47.5 23.95,47.45 LED4.C
  Bottom 0.406: R11.2 24,49.45 v24,47.5
N$21  (via drill 0.6)
  Top 0.406: v17,47.8 17.95,46.85 LED3.C
  Bottom 0.406: R12.2 17,49.45 v17,47.8
N$24  (via drill 0.6)
  Top 0.406: LED2.C 14,45.55 v14,47.9
  Bottom 0.406: R13.2 14,49.45 v14,47.9
NEUTRAL
  Top 1.5: B1.+ 56,36.38 56,41.62 50.38,47.25 X1.2
RELAY
  Top 0.4: JP1.1 R8.2
RX  (via drill 0.6)
  Top 0.406: v22,45.5 LED3.A
  Bottom 0.406: IC5.21 17.8,33.3 18,33.5 18.1,33.5 18.4,33.8 20.6,33.8 20.8,33.6 28.58,33.6 28.58,34.1 JP7.2 28.75,35.25 28,36 28,44.4 26.9,45.5 v22,45.5
TX
  Top 0.406: JP7.1 29.73,32.77 28,34.5 28,42.12 26.05,44.08 LED4.A
  Bottom 0.406: IC5.22 20.44,31.84 21.31,32.71 JP7.1
ZEROCROSSING
  Top 0.4: 59,20 59.12,20 61.5,17.62 63.25,17.62 R6.1 | 59,20 58.38,20 IC2.5 | JP1.2 63.88,25 59,20.12 59,20

### Text on the board
bPlace: A | B | B | A
tNames: + | -
_tNames: LED3 | LED4 | R5 | LED1 | LED2 | R9 | T1 | R15 | B1 | CX1 | IC2 | IC1 | R7 | R6 | D6 | R8 | T2
_bNames: R14 | R13 | R12 | R11 | C10 | C8 | R10 | R4 | C7 | IC4 | SJ4 | R3 | IC5 | C6 | R2 | R1 | IC3 | C1 | C5 | C3 | C2 | IC6 | SJ2 | C4